# Altium schematic sheet ThermocoupleCircuit.SchDoc: Set in Document Options » Parameters » Title
size Tabloid; Author: Set in Document Options » Parameters » Author + Contact info
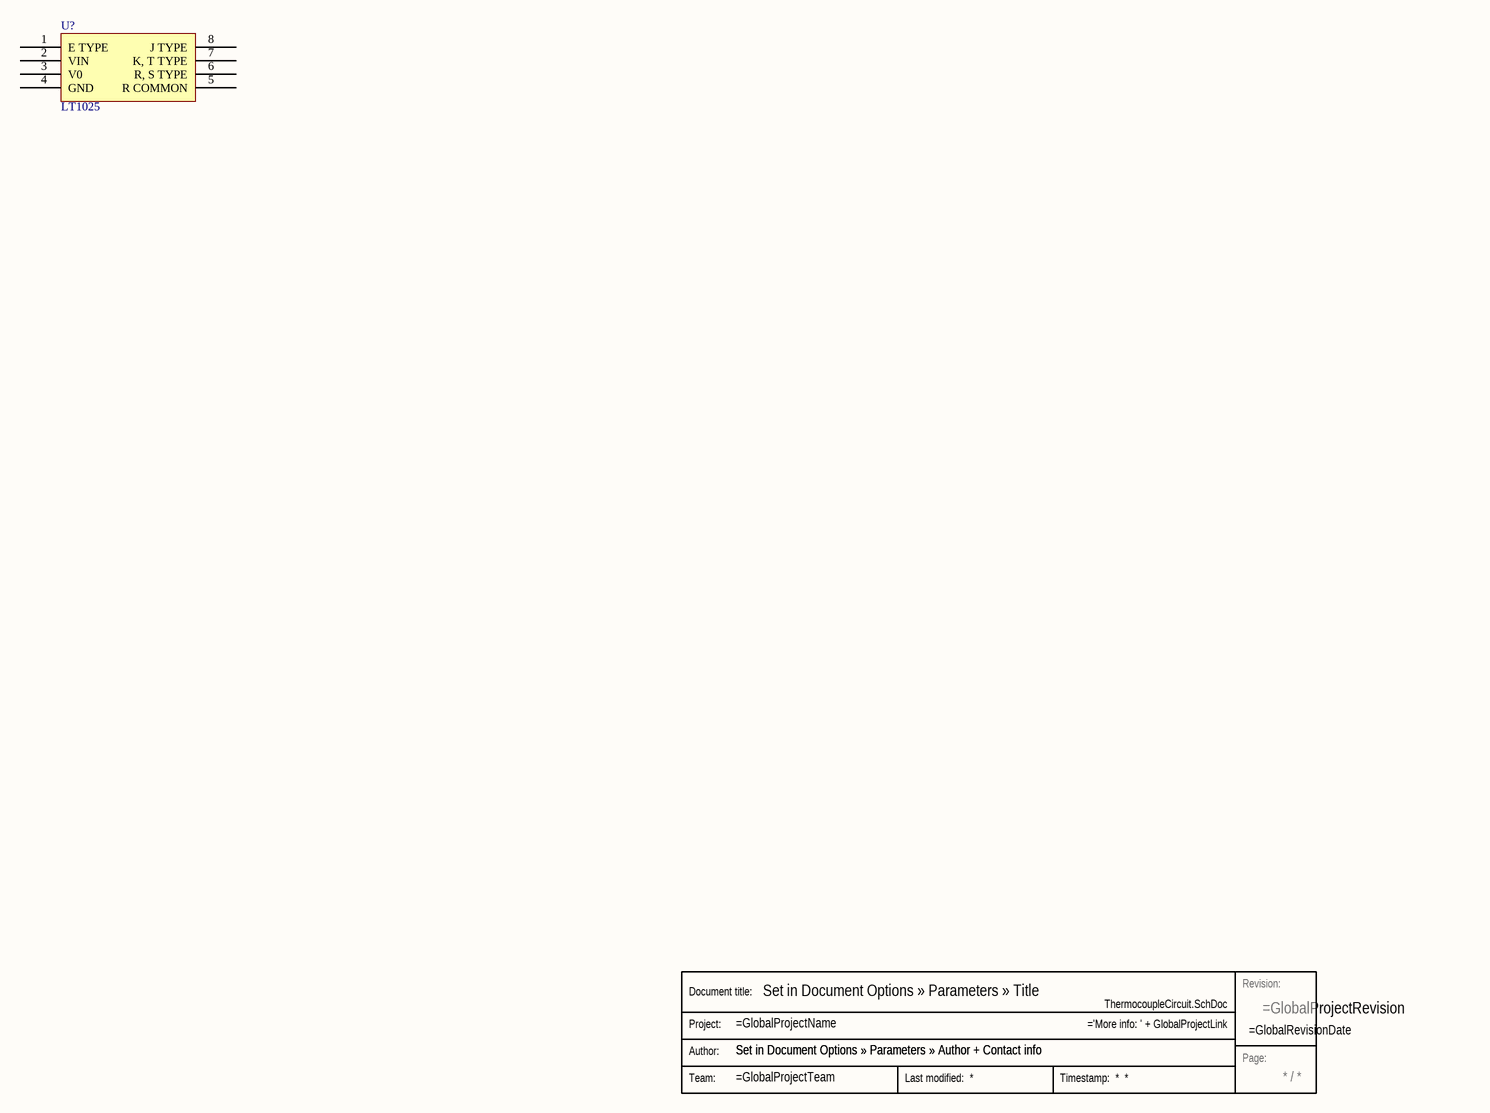
[diagram p0: ThermocoupleCircuit.SchDoc]

## Parts
Stamp  Stamp  (value not drawn)  (graphical)
U?  LT1025

## Nets

Not connected (* = marked no-connect by the designer): U? 1(E_TYPE) 2(VIN) 3(V0) 4(GND) 5(R_COMMON) 6(R,_S_TYPE) 7(K,_T_TYPE) 8(J_TYPE)

## Notes on the sheet
- (in symbol Stamp) Revision:; Document title:; Project:; Author:; Page:; Team:

## Library data of the parts
U? = LT1025: Manufacturer: Linear Technology; Digikey P/N: LT1025CS8#PBF-ND; Digikey Link: https://www.digikey.com/product-detail/en/LT1025CS8%23PBF/LT1025CS8%23PBF-ND/962708; Footprint: 8-SOIC; Manufacturer P/N: LT1025